# Altium schematic sheet IMU.SchDoc
size Letter; SheetNumber: 2; SheetTotal: 3
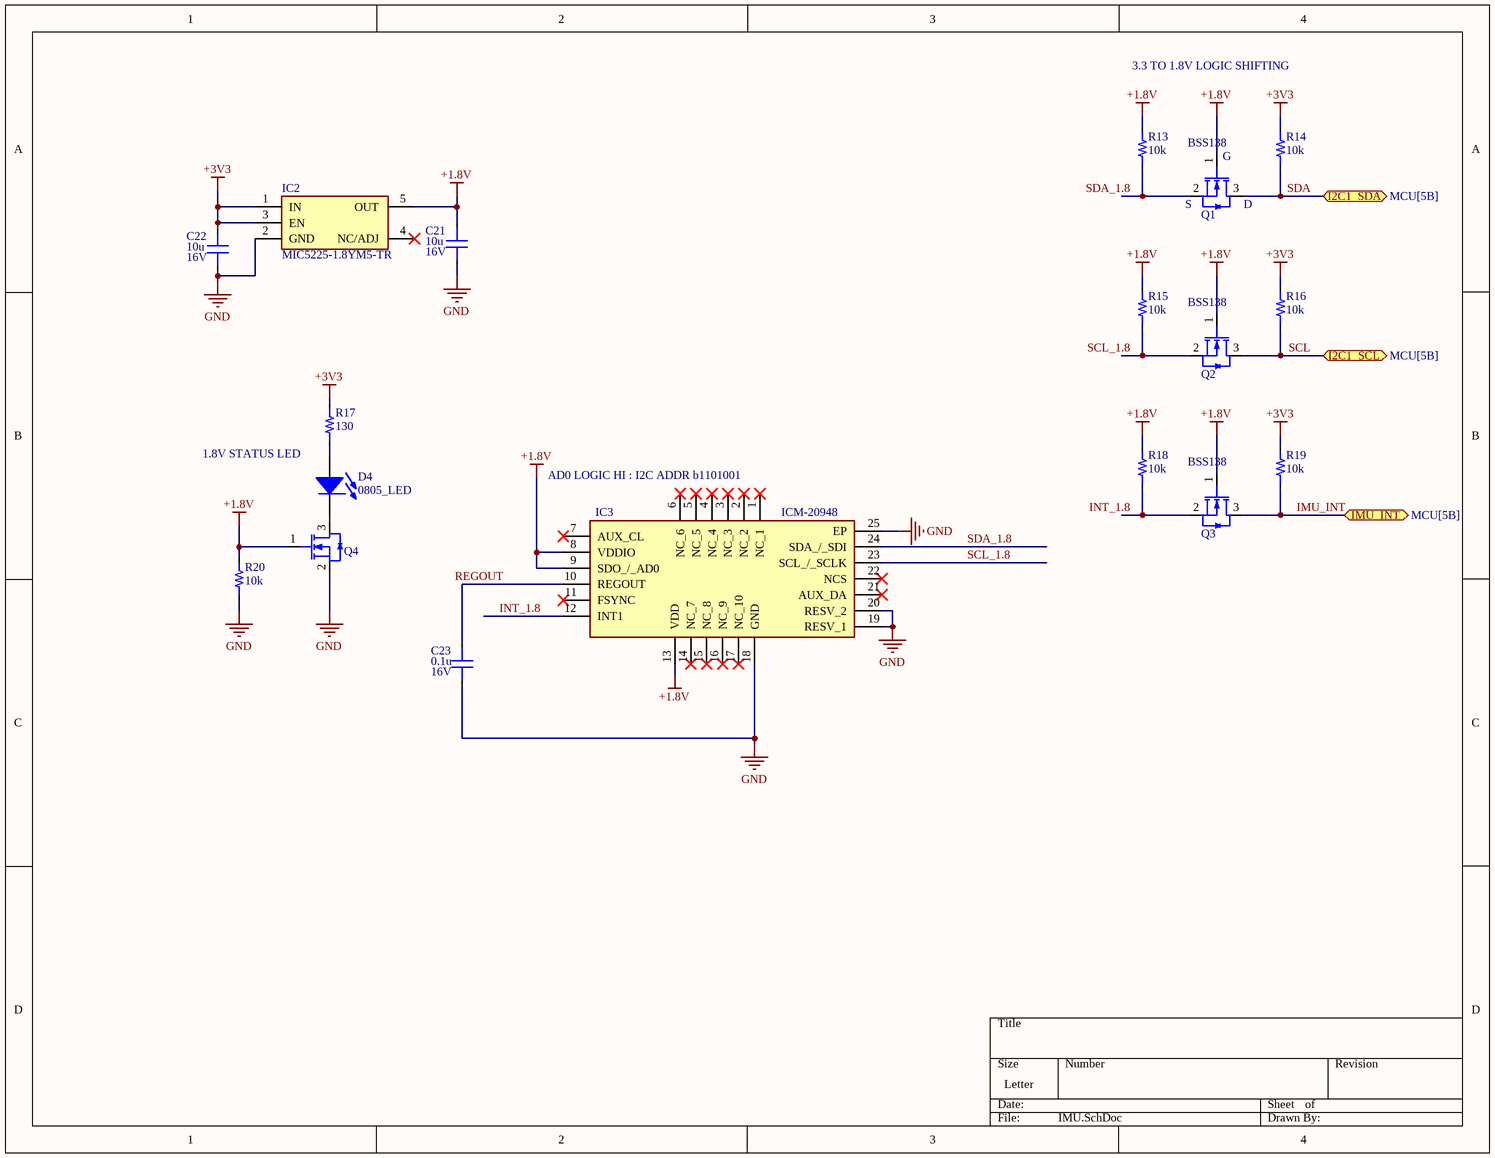
[diagram p0: IMU.SchDoc]

## Parts
C21  value 10u  Voltage: 16V  [0603_CAP]  (hidden comment: Capacitor)
C22  value 10u  Voltage: 16V  [0603_CAP]  (hidden comment: Capacitor)
C23  value 0.1u  Voltage: 16V  [0603_CAP]  (hidden comment: Capacitor)
D4  0805_LED  [0805_LED]
IC2  MIC5225-1.8YM5-TR  [SOT95P280X130-5N]
IC3  ICM-20948  [QFN40P300X300X105-25N-D]
Q1  BSS138  [SOT95P240X120-3N]
Q2  BSS138  [SOT95P240X120-3N]
Q3  BSS138  [SOT95P240X120-3N]
Q4  BSS138  [SOT95P240X120-3N]  (value not drawn)
R13  value 10k  [0603_RES]  (hidden comment: Resistor)
R14  value 10k  [0603_RES]  (hidden comment: Resistor)
R15  value 10k  [0603_RES]  (hidden comment: Resistor)
R16  value 10k  [0603_RES]  (hidden comment: Resistor)
R17  value 130  [0603_RES]  (hidden comment: Resistor)
R18  value 10k  [0603_RES]  (hidden comment: Resistor)
R19  value 10k  [0603_RES]  (hidden comment: Resistor)
R20  value 10k  [0603_RES]  (hidden comment: Resistor)

## Ports
I2C1_SCL (bidir, see MCU[5B]), I2C1_SDA (bidir, see MCU[5B]), IMU_INT (bidir, see MCU[5B])

## Nets
+1.8V: C21.2 IC2.5(OUT) IC3.8(VDDIO) IC3.9(SDO_/_AD0) IC3.13(VDD) Q1.1(G) Q2.1(G) Q3.1(G) Q4.1(G) R13.2 R15.2 R18.2 R20.2
+3V3: C22.2 IC2.1(IN) IC2.3(EN) R14.2 R16.2 R17.2 R19.2
GND: C21.1 C22.1 C23.1 IC2.2(GND) IC3.18(GND) IC3.19(RESV_1) IC3.20(RESV_2) IC3.25(EP) Q4.2(S) R20.1
IMU_INT: Q3.3(D) R19.1 ; port IMU_INT
INT_1.8: IC3.12(INT1) Q3.2(S) R18.1
REGOUT: C23.2 IC3.10(REGOUT)
SCL: Q2.3(D) R16.1 ; port I2C1_SCL
SCL_1.8: IC3.23(SCL_/_SCLK) Q2.2(S) R15.1
SDA: Q1.3(D) R14.1 ; port I2C1_SDA
SDA_1.8: IC3.24(SDA_/_SDI) Q1.2(S) R13.1
NetD4_1: D4.1(A) R17.1
NetD4_2: D4.2(K) Q4.3(D)

Not connected (* = marked no-connect by the designer): IC2 4(NC/ADJ)*; IC3 1(NC_1)* 2(NC_2)* 3(NC_3)* 4(NC_4)* 5(NC_5)* 6(NC_6)* 7(AUX_CL)* 11(FSYNC)* 14(NC_7)* 15(NC_8)* 16(NC_9)* 17(NC_10)* 21(AUX_DA)* 22(NCS)*

## Notes on the sheet
- 3.3 TO 1.8V LOGIC SHIFTING
- (near Q1) G
- (near Q1) S
- (near Q1) D
- 1.8V STATUS LED
- (near IC3) AD0 LOGIC HI : I2C ADDR b1101001

## Library data of the parts
D4 = 0805_LED: Generic 0805 LED
IC2 = MIC5225-1.8YM5-TR: Integrated Circuit; Manufacturer_Name: Microchip; Datasheet Link: http://www.microchip.com/mymicrochip/filehandler.aspx?ddocname=en579718; Height: 1.3mm; Manufacturer_Part_Number: MIC5225-1.8YM5-TR; Mouser Part Number: 998-MIC5225-1.8YM5TR; Mouser Price/Stock: https://www.mouser.co.uk/ProductDetail/Microchip-Technology/MIC5225-1.8YM5-TR?qs=U6T8BxXiZAW23RI71jjM5w%3D%3D; Arrow Part Number: MIC5225-1.8YM5-TR; Arrow Price/Stock: https://www.arrow.com/en/products/mic5225-1.8ym5-tr/microchip-technology?region=nac
IC3 = ICM-20948: Integrated Circuit; Manufacturer_Name: TDK; Datasheet Link: https://product.tdk.com/system/files/dam/doc/product/sensor/mortion-inertial/imu/data_sheet/ds-000189-icm-20948-v1.3.pdf; Height: 1.05mm; Manufacturer_Part_Number: ICM-20948; Mouser Part Number: 410-ICM-20948; Mouser Price/Stock: https://www.mouser.co.uk/ProductDetail/TDK-InvenSense/ICM-20948?qs=u4fy%2FsgLU9OtGc31yF%2Friw%3D%3D; Arrow Part Number: ICM-20948; Arrow Price/Stock: https://www.arrow.com/en/products/icm-20948/invensense?region=nac
Q1-Q4 = BSS138: MOSFET (N-Channel); Manufacturer_Name: onsemi; Datasheet Link: https://www.onsemi.com/pub/Collateral/BSS138-D.PDF; Height: 1.2mm; Manufacturer_Part_Number: BSS138; Mouser Part Number: 512-BSS138; Mouser Price/Stock: https://www.mouser.co.uk/ProductDetail/onsemi-Fairchild/BSS138?qs=HK%252BeIG1iaahCeqBvjB4arg%3D%3D; Arrow Part Number: BSS138; Arrow Price/Stock: https://www.arrow.com/en/products/bss138/on-semiconductor
C21-C23 = Capacitor: Dielectric: *; Percent Tolerance: *; ESR: *
R13-R20 = Resistor: Tolerance: *